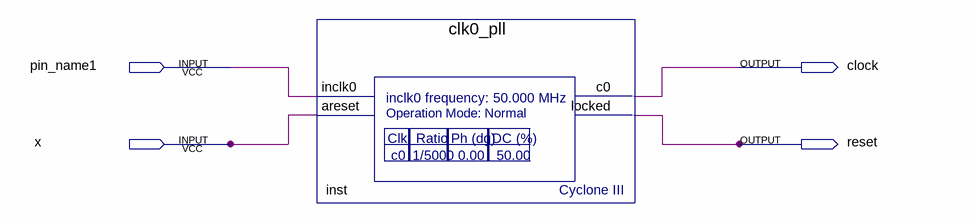
[diagram p0: schematic sheet]
// Quartus schematic clk0_pll.bdf as structural Verilog: 1 symbols, 4 pins
module clk0_pll (
  input  pin_name1,
  input  x,
  output clock,
  output reset
);

  clk0_pll inst (.inclk0(pin_name1), .areset(x), .c0(clock), .locked(reset));
endmodule
